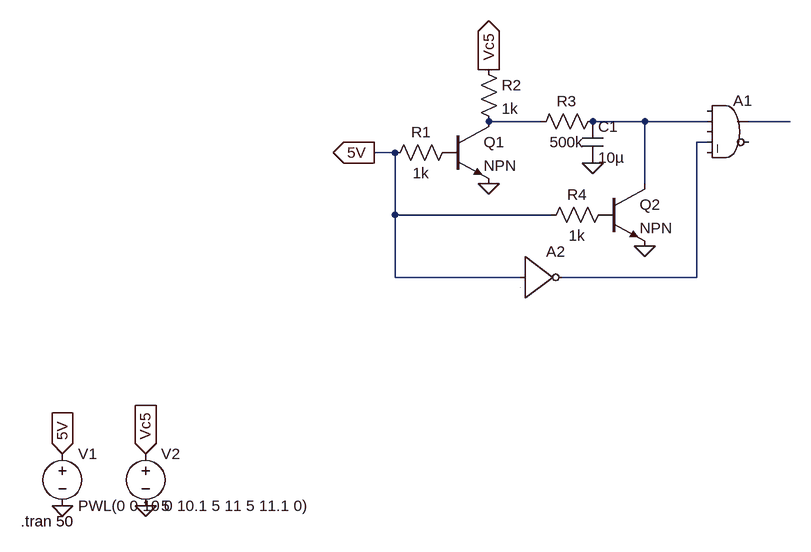
[diagram p0: schematic NPN_Timing.asc]
NPN_Timing.asc, the LTspice schematic file:
Version 4.1
SHEET 1 1412 680
WIRE 736 -288 656 -288
WIRE 896 -288 816 -288
WIRE 992 -288 896 -288
WIRE 1120 -288 1056 -288
WIRE 992 -256 976 -256
WIRE 512 -240 480 -240
WIRE 896 -192 896 -288
WIRE 512 -144 512 -240
WIRE 752 -144 512 -144
WIRE 512 -48 512 -144
WIRE 704 -48 512 -48
WIRE 976 -48 976 -256
WIRE 976 -48 768 -48
FLAG 0 304 0
FLAG 0 224 5V
IOPIN 0 224 In
FLAG 816 -224 0
FLAG 896 -96 0
FLAG 480 -240 5V
IOPIN 480 -240 Out
FLAG 656 -368 Vc5
IOPIN 656 -368 Out
FLAG 128 304 0
FLAG 128 224 Vc5
IOPIN 128 224 In
FLAG 656 -192 0
SYMBOL voltage 0 208 R0
WINDOW 123 0 0 Left 0
WINDOW 39 0 0 Left 0
SYMATTR InstName V1
SYMATTR Value PWL(0 0 10 0 10.1 5 11 5 11.1 0)
SYMBOL res 608 -256 R90
WINDOW 0 0 56 VBottom 2
WINDOW 3 32 56 VTop 2
SYMATTR InstName R1
SYMATTR Value 1k
SYMBOL res 640 -384 R0
SYMATTR InstName R2
SYMATTR Value 1k
SYMBOL res 832 -304 R90
WINDOW 0 0 56 VBottom 2
WINDOW 3 32 56 VTop 2
SYMATTR InstName R3
SYMATTR Value 500k
SYMBOL cap 800 -288 R0
SYMATTR InstName C1
SYMATTR Value 10µ
SYMATTR SpiceLine V=6.3 Irms=10.8 Rser=0.00432531 Lser=0
SYMBOL npn 592 -288 R0
SYMATTR InstName Q1
SYMBOL npn 832 -192 R0
SYMATTR InstName Q2
SYMBOL Digital\\and 1024 -336 R0
SYMATTR InstName A1
SYMBOL Digital\\inv 704 -112 R0
SYMATTR InstName A2
SYMBOL res 848 -160 R90
WINDOW 0 0 56 VBottom 2
WINDOW 3 32 56 VTop 2
SYMATTR InstName R4
SYMATTR Value 1k
SYMBOL voltage 128 208 R0
WINDOW 123 0 0 Left 0
WINDOW 39 0 0 Left 0
SYMATTR InstName V2
SYMATTR Value 5
TEXT -64 328 Left 2 !.tran 50

The netlist it stands for:
* NPN_Timing.asc
V1 5V 0 PWL(0 0 10 0 10.1 5 11 5 11.1 0)
R1 P001 5V 1k
R2 Vc5 N001 1k
R3 N002 N001 500k
C1 N002 0 10µ V=6.3 Irms=10.8 Rser=0.00432531 Lser=0
Q1 N001 P001 0 0 NPN
Q2 N002 P002 0 0 NPN
A1 0 N002 0 N004 0 0 N003 0 AND
A2 5V 0 0 0 0 N004 0 0 BUF
R4 P002 5V 1k
V2 Vc5 0 5
.model NPN NPN
.model PNP PNP
.lib standard.bjt
.tran 50
.backanno
.end